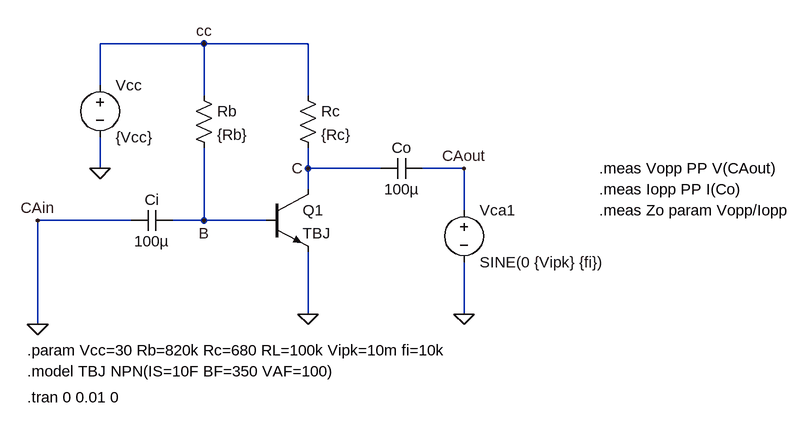
[diagram p0: schematic TBJ01CAZo.asc]
TBJ01CAZo.asc, the LTspice schematic file:
Version 4
SHEET 1 1608 928
WIRE 128 -16 -32 -16
WIRE 288 -16 128 -16
WIRE -32 48 -32 -16
WIRE 128 64 128 -16
WIRE 288 64 288 -16
WIRE -32 176 -32 128
WIRE 288 176 288 144
WIRE 400 176 288 176
WIRE 528 176 464 176
WIRE 288 208 288 176
WIRE 528 240 528 176
WIRE 16 256 -128 256
WIRE 128 256 128 144
WIRE 128 256 80 256
WIRE 224 256 128 256
WIRE 288 400 288 304
WIRE 528 400 528 320
WIRE -128 416 -128 256
FLAG -32 176 0
FLAG 288 400 0
FLAG -128 416 0
FLAG 128 -16 cc
FLAG -128 256 CAin
FLAG 528 400 0
FLAG 528 176 CAout
FLAG 128 256 B
FLAG 288 176 C
SYMBOL res 112 48 R0
SYMATTR InstName Rb
SYMATTR Value {Rb}
SYMBOL res 272 48 R0
SYMATTR InstName Rc
SYMATTR Value {Rc}
SYMBOL voltage -32 32 R0
WINDOW 123 0 0 Left 0
WINDOW 39 0 0 Left 0
SYMATTR InstName Vcc
SYMATTR Value {Vcc}
SYMBOL npn 224 208 R0
SYMATTR InstName Q1
SYMATTR Value TBJ
SYMBOL cap 80 240 R90
WINDOW 0 0 32 VBottom 2
WINDOW 3 32 32 VTop 2
SYMATTR InstName Ci
SYMATTR Value 100µ
SYMBOL cap 464 160 R90
WINDOW 0 0 32 VBottom 2
WINDOW 3 32 32 VTop 2
SYMATTR InstName Co
SYMATTR Value 100µ
SYMBOL voltage 528 224 R0
WINDOW 123 0 0 Left 0
WINDOW 39 0 0 Left 0
SYMATTR InstName Vca1
SYMATTR Value SINE(0 {Vipk} {fi})
TEXT -144 528 Left 2 !.tran 0 0.01 0
TEXT 736 176 Left 2 !.meas Vopp PP V(CAout)
TEXT 736 208 Left 2 !.meas Iopp PP I(Co)
TEXT 736 240 Left 2 !.meas Zo param Vopp/Iopp
TEXT -144 456 Left 2 !.param Vcc=30 Rb=820k Rc=680 RL=100k Vipk=10m fi=10k
TEXT -144 488 Left 2 !.model TBJ NPN(IS=10F BF=350 VAF=100)

The netlist it stands for:
* TBJ01CAZo.asc
Rb cc B {Rb}
Rc cc C {Rc}
Vcc cc 0 {Vcc}
Q1 C B 0 0 TBJ
Ci B 0 100µ
Co CAout C 100µ
Vca1 CAout 0 SINE(0 {Vipk} {fi})
.model NPN NPN
.model PNP PNP
.lib standard.bjt
.tran 0 0.01 0
.meas Vopp PP V(CAout)
.meas Iopp PP I(Co)
.meas Zo param Vopp/Iopp
.param Vcc=30 Rb=820k Rc=680 RL=100k Vipk=10m fi=10k
.model TBJ NPN(IS=10F BF=350 VAF=100)
.backanno
.end